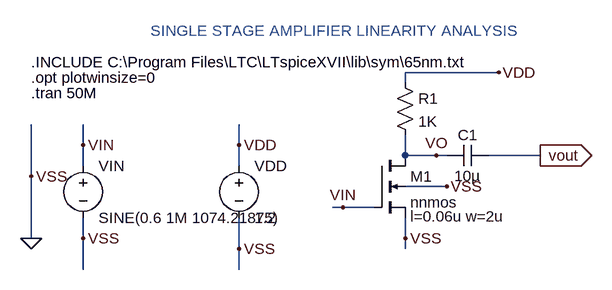
[diagram p0: schematic 9SINGLE STAGE AMPLIFIER LINEARITY ANALYSIS.asc]
9SINGLE STAGE AMPLIFIER LINEARITY ANALYSIS.asc, the LTspice schematic file:
Version 4
SHEET 1 880 680
WIRE 528 64 384 64
WIRE 384 80 384 64
WIRE -112 176 -112 144
WIRE 128 176 128 144
WIRE 384 192 384 160
WIRE 432 192 384 192
WIRE 448 192 432 192
WIRE 592 192 512 192
WIRE -112 208 -112 176
WIRE 128 208 128 176
WIRE -192 224 -192 144
WIRE 448 240 384 240
WIRE 288 272 272 272
WIRE 336 272 288 272
WIRE -192 320 -192 224
WIRE -112 320 -112 288
WIRE 384 320 384 288
WIRE 128 336 128 288
WIRE 384 336 384 320
WIRE -112 368 -112 320
WIRE 128 368 128 336
FLAG 592 192 vout
IOPIN 592 192 Out
FLAG -192 320 0
FLAG -192 224 VSS
FLAG -112 320 VSS
FLAG 128 336 VSS
FLAG 448 240 VSS
FLAG 384 320 VSS
FLAG 128 176 VDD
FLAG 528 64 VDD
FLAG -112 176 VIN
FLAG 288 272 VIN
FLAG 432 192 VO
SYMBOL nmos4 336 192 R0
WINDOW 123 56 94 Left 2
SYMATTR InstName M1
SYMATTR Value nnmos
SYMATTR Value2 l=0.06u w=2u
SYMBOL res 368 64 R0
SYMATTR InstName R1
SYMATTR Value 1K
SYMBOL cap 512 176 R90
WINDOW 0 0 32 VBottom 2
WINDOW 3 32 32 VTop 2
SYMATTR InstName C1
SYMATTR Value 10µ
SYMBOL voltage 128 192 R0
SYMATTR InstName VDD
SYMATTR Value 1.2
SYMBOL voltage -112 192 R0
WINDOW 123 24 118 Left 2
WINDOW 39 0 0 Left 0
SYMATTR InstName VIN
SYMATTR Value SINE(0.6 1M 1074.21875)
TEXT -192 48 Left 2 !.INCLUDE C:\\Program Files\\LTC\\LTspiceXVII\\lib\\sym\\65nm.txt
TEXT -192 72 Left 2 !.opt plotwinsize=0
TEXT -192 96 Left 2 !.tran 50M
TEXT -8 0 Left 2 ;SINGLE STAGE AMPLIFIER LINEARITY ANALYSIS

The netlist it stands for:
* 9SINGLE STAGE AMPLIFIER LINEARITY ANALYSIS.asc
M1 VO VIN 0 0 nnmos l=0.06u w=2u
R1 VDD VO 1K
C1 vout VO 10µ
VDD VDD 0 1.2
VIN VIN 0 SINE(0.6 1M 1074.21875)
.model NMOS NMOS
.model PMOS PMOS
.lib standard.mos
.INCLUDE C:\Program Files\LTC\LTspiceXVII\lib\sym\65nm.txt
.opt plotwinsize=0
.tran 50M
* SINGLE STAGE AMPLIFIER LINEARITY ANALYSIS
.backanno
.end